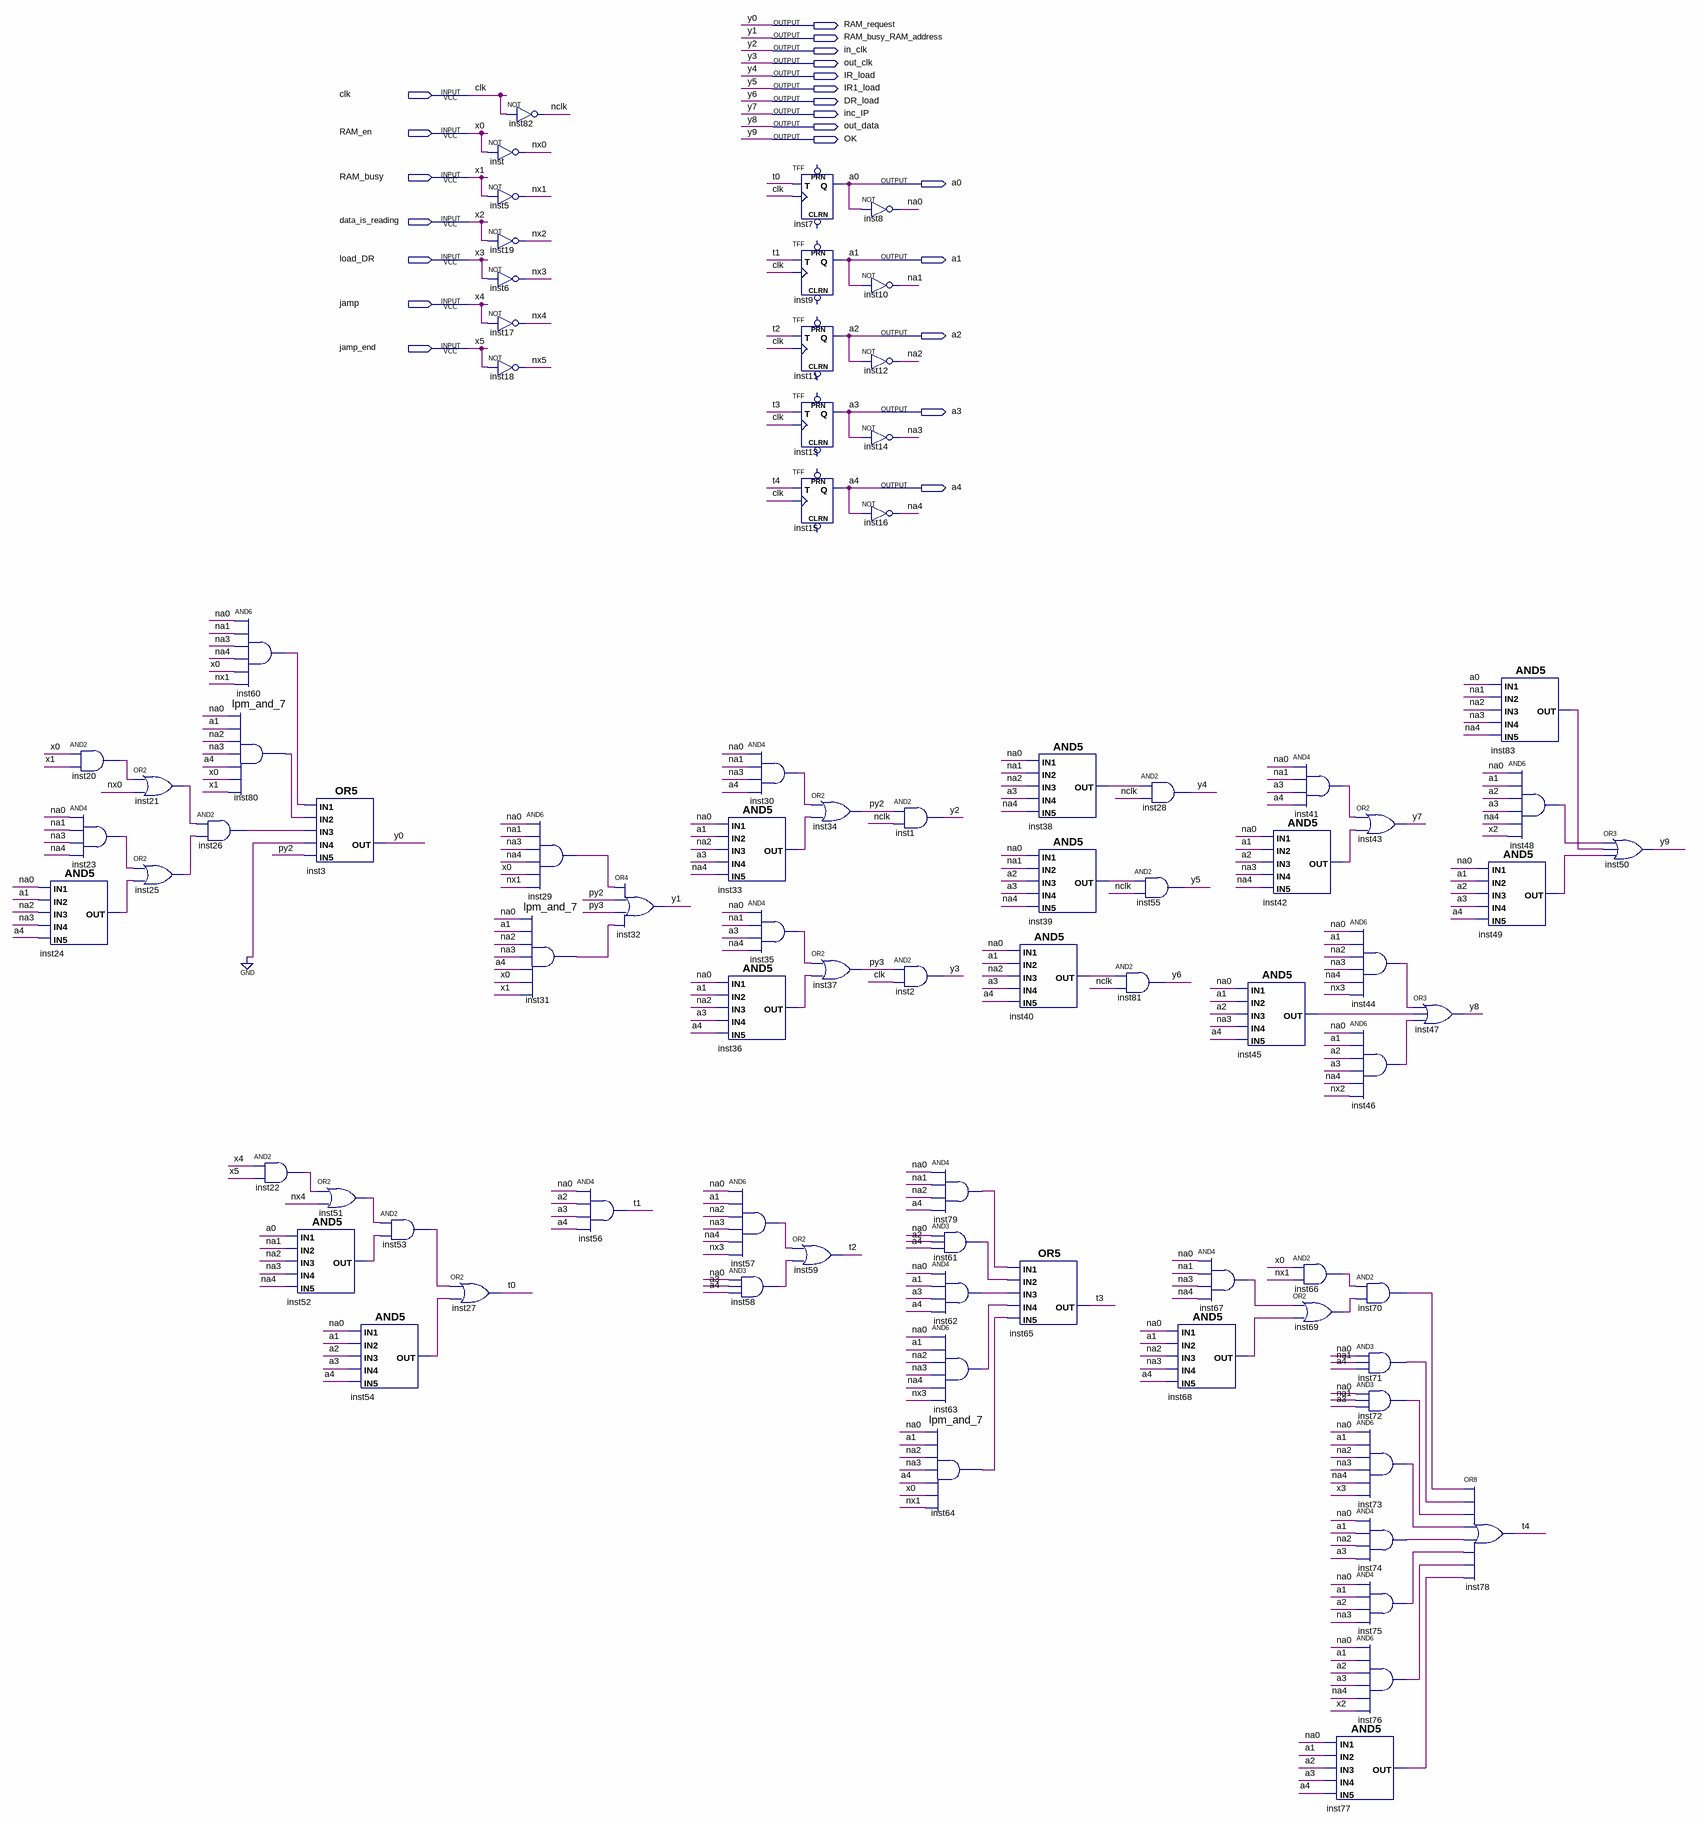
[diagram p0: schematic sheet]
// Quartus schematic read_command.bdf as structural Verilog: 83 symbols, 22 pins
module read_command (
  input  clk,
  input  RAM_en,
  input  RAM_busy,
  input  data_is_reading,
  input  load_DR,
  input  jamp,
  input  jamp_end,
  output RAM_request,
  output RAM_busy_RAM_address,
  output in_clk,
  output out_clk,
  output IR_load,
  output IR1_load,
  output DR_load,
  output inc_IP,
  output out_data,
  output OK,
  output a0,
  output a1,
  output a2,
  output a3,
  output a4
);

  wire inst20_out, inst21_out, inst22_out, inst23_out, inst24_out, inst25_out, inst26_out, inst29_out,
       inst30_out, inst31_result, inst33_out, inst35_out, inst36_out, inst38_out, inst39_out, inst40_out,
       inst41_out, inst42_out, inst44_out, inst45_out, inst46_out, inst48_out, inst49_out, inst51_out,
       inst52_out, inst53_out, inst54_out, inst57_out, inst58_out, inst60_out, inst61_out, inst62_out,
       inst63_out, inst64_result, inst66_out, inst67_out, inst68_out, inst69_out, inst70_out, inst71_out,
       inst72_out, inst73_out, inst74_out, inst75_out, inst76_out, inst77_out, inst79_out, inst80_result,
       inst83_out, na0, na1, na2, na3, na4, nclk, nx0, nx1, nx2, nx3, nx4, nx5, py2, py3, t0, t1, t2, t3, t4;

  and inst20 (inst20_out, RAM_en, RAM_busy);
  and inst23 (inst23_out, na0, na1, na3, na4);
  and inst24 (inst24_out, na0, a1, na2, na3, a4);
  or inst21 (inst21_out, inst20_out, nx0);
  or inst25 (inst25_out, inst23_out, inst24_out);
  lpm_and_7 inst80 (
    .data0(na0), .data1(a1), .data2(na2), .data3(na3), .data4(a4), .data5(RAM_en), .data6(RAM_busy),
    .result(inst80_result));
  and inst26 (inst26_out, inst21_out, inst25_out);
  and inst60 (inst60_out, na0, na1, na3, na4, RAM_en, nx1);
  and inst22 (inst22_out, jamp, jamp_end);
  or inst3 (RAM_request, inst60_out, inst80_result, inst26_out, 1'b0, py2);
  or inst51 (inst51_out, inst22_out, nx4);
  and inst52 (inst52_out, a0, na1, na2, na3, na4);
  and inst53 (inst53_out, inst51_out, inst52_out);
  and inst54 (inst54_out, na0, a1, a2, a3, a4);
  or inst27 (t0, inst53_out, inst54_out);
  not inst82 (nclk, clk);
  not inst (nx0, RAM_en);
  not inst5 (nx1, RAM_busy);
  not inst19 (nx2, data_is_reading);
  not inst6 (nx3, load_DR);
  not inst17 (nx4, jamp);
  not inst18 (nx5, jamp_end);
  and inst29 (inst29_out, na0, na1, na3, na4, RAM_en, nx1);
  lpm_and_7 inst31 (
    .data0(na0), .data1(a1), .data2(na2), .data3(na3), .data4(a4), .data5(RAM_en), .data6(RAM_busy),
    .result(inst31_result));
  and inst56 (t1, na0, a2, a3, a4);
  or inst32 (RAM_busy_RAM_address, inst29_out, py2, py3, inst31_result);
  and inst33 (inst33_out, na0, a1, na2, a3, na4);
  and inst36 (inst36_out, na0, a1, na2, a3, a4);
  and inst57 (inst57_out, na0, a1, na2, na3, na4, nx3);
  and inst58 (inst58_out, na0, a3, a4);
  and inst30 (inst30_out, na0, na1, na3, a4);
  and inst35 (inst35_out, na0, na1, a3, na4);
  TFF inst7 (.T(t0), .CLK(clk), .Q(a0));  // open: PRN, CLRN
  TFF inst9 (.T(t1), .CLK(clk), .Q(a1));  // open: PRN, CLRN
  TFF inst11 (.T(t2), .CLK(clk), .Q(a2));  // open: PRN, CLRN
  TFF inst13 (.T(t3), .CLK(clk), .Q(a3));  // open: PRN, CLRN
  TFF inst15 (.T(t4), .CLK(clk), .Q(a4));  // open: PRN, CLRN
  or inst34 (py2, inst30_out, inst33_out);
  or inst37 (py3, inst35_out, inst36_out);
  or inst59 (t2, inst57_out, inst58_out);
  not inst8 (na0, a0);
  not inst10 (na1, a1);
  not inst12 (na2, a2);
  not inst14 (na3, a3);
  not inst16 (na4, a4);
  and inst1 (in_clk, py2, nclk);
  and inst2 (out_clk, py3, clk);
  and inst79 (inst79_out, na0, na1, na2, a4);
  and inst61 (inst61_out, na0, a2, a4);
  and inst62 (inst62_out, na0, a1, a3, a4);
  and inst63 (inst63_out, na0, a1, na2, na3, na4, nx3);
  lpm_and_7 inst64 (
    .data0(na0), .data1(a1), .data2(na2), .data3(na3), .data4(a4), .data5(RAM_en), .data6(nx1),
    .result(inst64_result));
  and inst38 (inst38_out, na0, na1, na2, a3, na4);
  and inst39 (inst39_out, na0, na1, a2, a3, na4);
  and inst40 (inst40_out, na0, a1, na2, a3, a4);
  or inst65 (t3, inst79_out, inst61_out, inst62_out, inst63_out, inst64_result);
  and inst28 (IR_load, inst38_out, nclk);
  and inst55 (IR1_load, inst39_out, nclk);
  and inst81 (DR_load, inst40_out, nclk);
  and inst68 (inst68_out, na0, a1, na2, na3, a4);
  and inst45 (inst45_out, na0, a1, a2, na3, a4);
  and inst67 (inst67_out, na0, na1, na3, na4);
  and inst41 (inst41_out, na0, na1, a3, a4);
  and inst42 (inst42_out, na0, a1, a2, na3, na4);
  and inst66 (inst66_out, RAM_en, nx1);
  or inst69 (inst69_out, inst67_out, inst68_out);
  and inst77 (inst77_out, na0, a1, a2, a3, a4);
  or inst43 (inc_IP, inst41_out, inst42_out);
  and inst44 (inst44_out, na0, a1, na2, na3, na4, nx3);
  and inst46 (inst46_out, na0, a1, a2, a3, na4, nx2);
  and inst70 (inst70_out, inst66_out, inst69_out);
  and inst71 (inst71_out, na0, na1, a4);
  and inst72 (inst72_out, na0, na1, a3);
  and inst73 (inst73_out, na0, a1, na2, na3, na4, load_DR);
  and inst74 (inst74_out, na0, a1, na2, a3);
  and inst75 (inst75_out, na0, a1, a2, na3);
  and inst76 (inst76_out, na0, a1, a2, a3, na4, data_is_reading);
  or inst47 (out_data, inst44_out, inst45_out, inst46_out);
  and inst83 (inst83_out, a0, na1, na2, na3, na4);
  and inst49 (inst49_out, na0, a1, a2, a3, a4);
  or inst78 (t4, inst70_out, inst71_out, inst72_out, inst73_out, inst74_out, inst75_out, inst76_out, inst77_out);
  and inst48 (inst48_out, na0, a1, a2, a3, na4, data_is_reading);
  or inst50 (OK, inst48_out, inst83_out, inst49_out);

  // Other names for the same wires on the sheet: x0 = RAM_en; x1 = RAM_busy; x2 = data_is_reading; x3 = load_DR;
  //   x4 = jamp; x5 = jamp_end; y0 = RAM_request; y1 = RAM_busy_RAM_address; y2 = in_clk; y3 = out_clk; y4 = IR_load;
  //   y5 = IR1_load; y6 = DR_load; y7 = inc_IP; y8 = out_data; y9 = OK
endmodule
